# Altium schematic sheet PSU.SchDoc
size A4
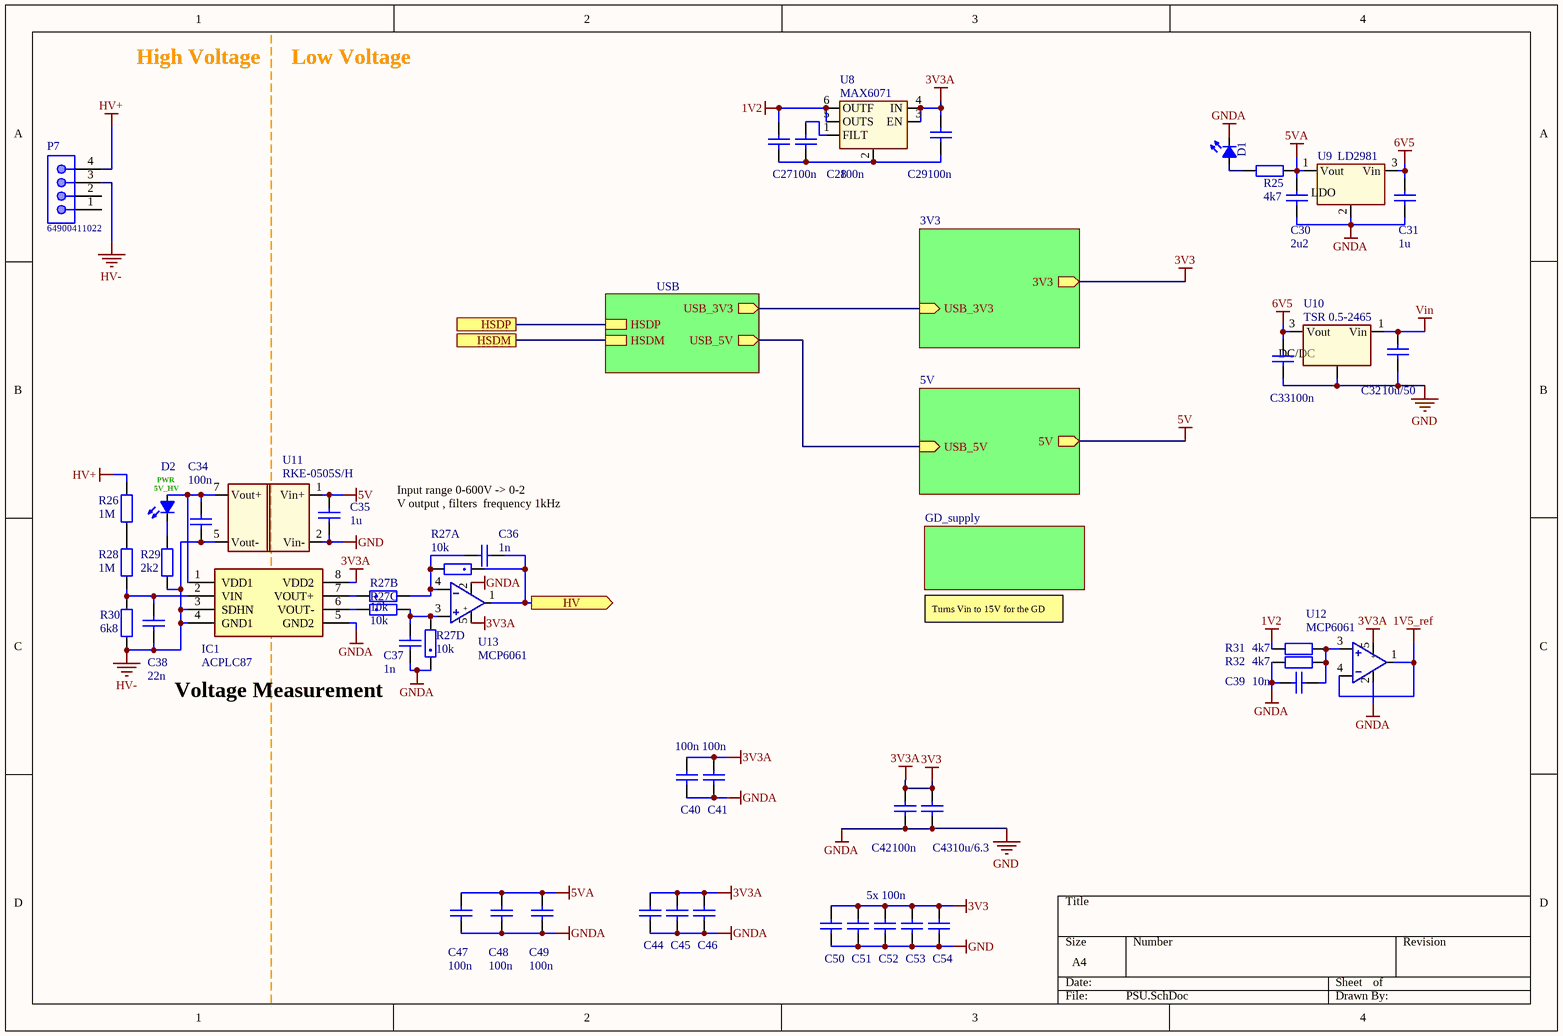
[diagram p0: PSU.SchDoc]

## Parts
C27  100n  [C_0603]
C28  100n  [C_0603]
C29  100n  [C_0603]
C30  2u2  [C_0805]
C31  1u  [C_0805]
C32  10u/50  [C_1210]
C33  100n  [C_0603]
C34  100n  [C_0603]
C35  1u  [C_0805]
C36  1n  [C_0603]
C37  1n  [C_0603]
C38  22n  [C_0603]
C39  10n  [C_0603]
C40  100n  [C_0603]
C41  100n  [C_0603]
C42  100n  [C_0603]
C43  10u/6.3  [C_1210]
C44  100n  [C_0603]  (value not drawn)
C45  100n  [C_0603]  (value not drawn)
C46  100n  [C_0603]  (value not drawn)
C47  100n  [C_0603]
C48  100n  [C_0603]
C49  100n  [C_0603]
C50  100n  [C_0603]  (value not drawn)
C51  100n  [C_0603]  (value not drawn)
C52  100n  [C_0603]  (value not drawn)
C53  100n  [C_0603]  (value not drawn)
C54  100n  [C_0603]  (value not drawn)
D1  Green  [D0603]  (value not drawn)
D2  Green  [D0603]  (value not drawn)
IC1  ACPLC87  [IC_ACPL87]
P7  64900411022  [64900411022]
R25  4k7  [R_0603]
R26  1M  [R_1206]
R27  10k  [R_Array  4D03]  (parts A,B,C,D of 4)
R28  1M  [R_1206]
R29  2k2  [R_0603]
R30  6k8  [R_0603]
R31  4k7  [R_0603]
R32  4k7  [R_0603]
U8  MAX6071  [sot23-6]
U9  LD2981  [SOT89]
U10  TSR 0.5-2465  [DCDC_Wurth_173950x36]
U11  RKE-0505S/H  [DCDC_RKExxxxSH]
U12  MCP6061  [SOT23-5]
U13  MCP6061  [SOT23-5]

## Sub-sheets
3V3 = 3V3.SchDoc: 3V3 (out), USB_3V3 (in)
5V = 5V.SchDoc: 5V (out), USB_5V (in)
GD_supply = GD_supply.SchDoc: no entries
USB = USB.SchDoc: USB_5V (out), USB_3V3 (out), HSDP, HSDM

## Ports
HSDM, HSDP, HV (out)

## Nets
1V2: C27.2 R31.1 U8.5(OUTS) U8.6(OUTF)
1V5_ref: U12.1(out_A) U12.4(IN-)
3V3: C29.2 C40.2 C41.2 C42.2 C43.1 C44.2 C45.2 C46.2 C50.2 C51.2 C52.2 C53.2 C54.2 IC1.8(VDD2) U8.3(EN) U8.4(IN) U12.5(vdd) U13.5(vdd) ; sheet 3V3/3V3  [also labelled 3V3A]
5V: C35.1 U11.1(Vin+) ; sheet 5V/5V
5VA: C30.1 C47.1 C48.1 C49.1 R25.2 U9.1(Vout)
6V5: C31.2 C33.2 U9.3(Vin) U10.3(Vout)
GND: C30.2 C31.1 C32.2 C33.1 C35.2 C37.2 C39.2 C40.1 C41.1 C42.1 C43.2 C44.1 C45.1 C46.1 C47.2 C48.2 C49.2 C50.1 C51.1 C52.1 C53.1 C54.1 D1.1(K) IC1.5(GND2) R27.4 R32.2 U9.2(GND) U10.2(GND) U11.2(Vin-) U12.2(vss) U13.2(vss)  [also labelled GNDA]
HV+: P7.4 R26.1
HV-: C34.2 C38.2 IC1.3(SDHN) IC1.4(GND1) P7.3 R29.1 R30.2 U11.5(Vout-)
Vin: C32.1 U10.1(Vin)
HSDM: port HSDM, sheet USB/HSDM
HSDP: port HSDP, sheet USB/HSDP
HV: C36.2 R27.1 U13.1(out_A) ; port HV
NetC27_1: C27.1 C28.1 C29.1 U8.2(GND)
NetC28_2: C28.2 U8.1(FILT)
NetC34_1: C34.1 D2.2(A) IC1.1(VDD1) U11.7(Vout+)
NetC36_1: C36.1 R27.7 R27.8 U13.4(IN-)
NetC37_1: C37.1 R27.5 R27.6 U13.3(IN+)
NetC38_1: C38.1 IC1.2(VIN) R28.2 R30.1
NetC39_1: C39.1 R31.2 R32.1 U12.3(IN+)
NetD1_2: D1.2(A) R25.1
NetD2_1: D2.1(K) R29.2
NetIC1_6: IC1.6(VOUT-) R27.3
NetIC1_7: IC1.7(VOUT+) R27.2
NetR26_2: R26.2 R28.1
(unnamed): sheet 3V3/USB_3V3, sheet USB/USB_3V3
(unnamed): sheet 5V/USB_5V, sheet USB/USB_5V

Not connected (* = marked no-connect by the designer): P7 1 2

## Notes on the sheet
- High Voltage
- Low Voltage
- PWR
  5V_HV
- Input range 0-600V -> 0-2
  V output , filters  frequency 1kHz
- Turns Vin to 15V for the GD
- Voltage Measurement
- 5x 100n
- (in symbol IC_ANA_MCP6061) +
- (in symbol IC_LDO_LD2981) LDO
- (in symbol PWR_TSR1-2450) DC/DC

## Library data of the parts
C27-C54 = C_MLCC: cond
  C27-C29 C33 C34 C40-C42 C50-C54: Value: 100n
  C30: Value: 2u2
  C31 C35: Value: 1u
  C32: Value: 10u/50
  C36 C37: Value: 1n
  C38: Value: 22n
  C39: Value: 10n
  C43: Value: 10u/6.3
  C44 C47: Value: 100n; ClassName: CH1
  C45 C48: Value: 100n; ClassName: CH2
  C46 C49: Value: 100n; ClassName: CH3
D1 D2 = D_LED small: LED diode
IC1 = IC_ANA_AmpISO_ACPLC87: isolation amplifier, 2V -1-GΩ  input; Manufacturer_Name: Avago Technologies; Manufacturer_Part_Number: ACPL-C87B-000E; Datasheet Link: https://componentsearchengine.com/Datasheets/2/ACPL-C87B-000E.pdf; Height: 3.307mm; Mouser Part Number: 630-ACPL-C87B-000E; Mouser Price/Stock: https://www.mouser.com/Search/Refine.aspx?Keyword=630-ACPL-C87B-000E; RS Part Number: 7687907P; RS Price/Stock: http://uk.rs-online.com/web/p/products/7687907P; ComponentLink1Description: Datasheet; ComponentLink1URL: https://docs.broadcom.com/docs/AV02-3563EN
P7 = 64900411022: THT Male Header WR-MPC4, with Mounting Flanges for Screw-in Retention, Right Angled, Single Row, pitch 4.2 mm, 4 pins; Pitch: 4.2 mm; Working Voltage: 600 VAC; Contact Resistance: 10 mOhm; Pin Number: 4; ComponentLink1Description: Manufacturer; ComponentLink1URL: http://www.we-online.de; ComponentLink2Description: Datasheet; ComponentLink2URL: https://katalog.we-online.de/em/datasheet/6490xx11022.pdf; Part Number: 64900411022; Published Date: November 2019; Publisher: Wurth Elektronik; Operating Temperature: -40 to 105 degC; Packaging: Tray; Gender: Male; Mounting Technology: THT; Orientation: Right Angled
R25 R26 R28-R32 = R_Uni: Resistor
  R25 R31 R32: Value: 4k7
  R26 R28: Value: 1M; ComponentLink1Description: Datasheet; ComponentLink1URL: https://www.mouser.sk/datasheet/2/54/CHV-777595.pdf
  R29: Value: 2k2
  R30: Value: 6k8
R27 = R_Array 4xR: Resistor array 4xR,  size 1206, 64mW; Name_: Michal Minarik; Wattage: 1/16W; Working voltage: 50V; DATE_: 10.5.2018
U8 = IC_LDO_REF_MAX6071: 3,00V ref
U9 = IC_LDO_LD2981: 5V sot 89; ComponentLink1Description: Datasheet; ComponentLink1URL: https://www.mouser.sk/datasheet/2/389/ld2981-974077.pdf
U10 = PWR_TSR1-2450: DC/DC Out: 5V 1A  In: 9-36V; ComponentLink1Description: Datasheet; ComponentLink1URL: https://www.mouser.sk/datasheet/2/687/tsr05-536572.pdf
U11 = PWR_RKE_H: Dc/Dc ISO 3kV Recom RKE Series 200mA; ComponentLink1Description: Datasheet; ComponentLink1URL: https://www.mouser.sk/datasheet/2/468/RKE-940986.pdf
U12 U13 = IC_ANA_MCP6061: Vcc:1.8 -6V, Vo:150uA. Iq:60uA; Manufacturer: Microchip; Manufacturer Part Number: MCP6061T-E/OT; No. of Comparators: 1 Comparator; Supply Voltage Range: 1.8V to 6V; No. of Pins: 5; Supplier 1: Mouser; Supplier Part Number 1: 579-MCP6061T-E/OT; ComponentLink1Description: Datasheet; ComponentLink1URL: http://ww1.microchip.com/downloads/en/DeviceDoc/MCP6061_DS22189B.pdf